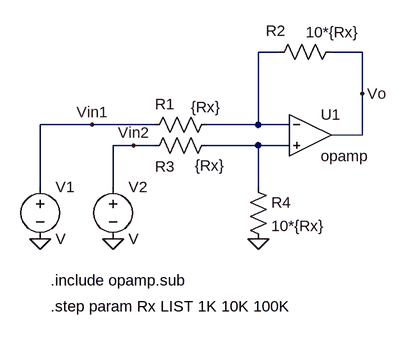
[diagram p0: schematic task_1.asc]
task_1.asc, the LTspice schematic file:
Version 4
SHEET 1 880 680
WIRE 192 48 160 48
WIRE 320 48 272 48
WIRE 320 112 320 48
WIRE -96 160 -176 160
WIRE 0 160 -96 160
WIRE 160 160 160 48
WIRE 160 160 80 160
WIRE 208 160 160 160
WIRE 320 176 320 112
WIRE 320 176 272 176
WIRE -32 192 -64 192
WIRE 0 192 -32 192
WIRE 160 192 80 192
WIRE 208 192 160 192
WIRE -176 256 -176 160
WIRE -64 256 -64 192
WIRE 160 256 160 192
FLAG 160 336 0
FLAG -64 336 0
FLAG -176 336 0
FLAG -96 160 Vin1
FLAG -32 192 Vin2
FLAG 320 112 Vo
SYMBOL Opamps\\opamp 240 112 R0
SYMATTR InstName U1
SYMBOL res 96 144 R90
WINDOW 0 0 80 VBottom 2
WINDOW 3 -27 17 VTop 2
SYMATTR InstName R1
SYMATTR Value {Rx}
SYMBOL res 288 32 R90
WINDOW 0 -1 101 VBottom 2
WINDOW 3 -30 14 VTop 2
SYMATTR InstName R2
SYMATTR Value 10*{Rx}
SYMBOL res 96 176 R90
WINDOW 0 64 80 VBottom 2
WINDOW 3 31 11 VTop 2
SYMATTR InstName R3
SYMATTR Value {Rx}
SYMBOL res 144 240 R0
SYMATTR InstName R4
SYMATTR Value 10*{Rx}
SYMBOL voltage -176 240 R0
SYMATTR InstName V1
SYMBOL voltage -64 240 R0
SYMATTR InstName V2
TEXT -160 400 Left 2 !.include opamp.sub
TEXT -160 440 Left 2 !.step param Rx LIST 1K 10K 100K

The netlist it stands for:
* task_1.asc
XU1 N001 N002 Vo opamp Aol=100K GBW=10Meg  ; pins invin noninvin out
R1 N001 Vin1 {Rx}
R2 Vo N001 10*{Rx}
R3 N002 Vin2 {Rx}
R4 N002 0 10*{Rx}
V1 Vin1 0 V
V2 Vin2 0 V
.include opamp.sub
.step param Rx LIST 1K 10K 100K
.backanno
.end